# EAGLE design xmosio1 (EAGLE 7.6.0)
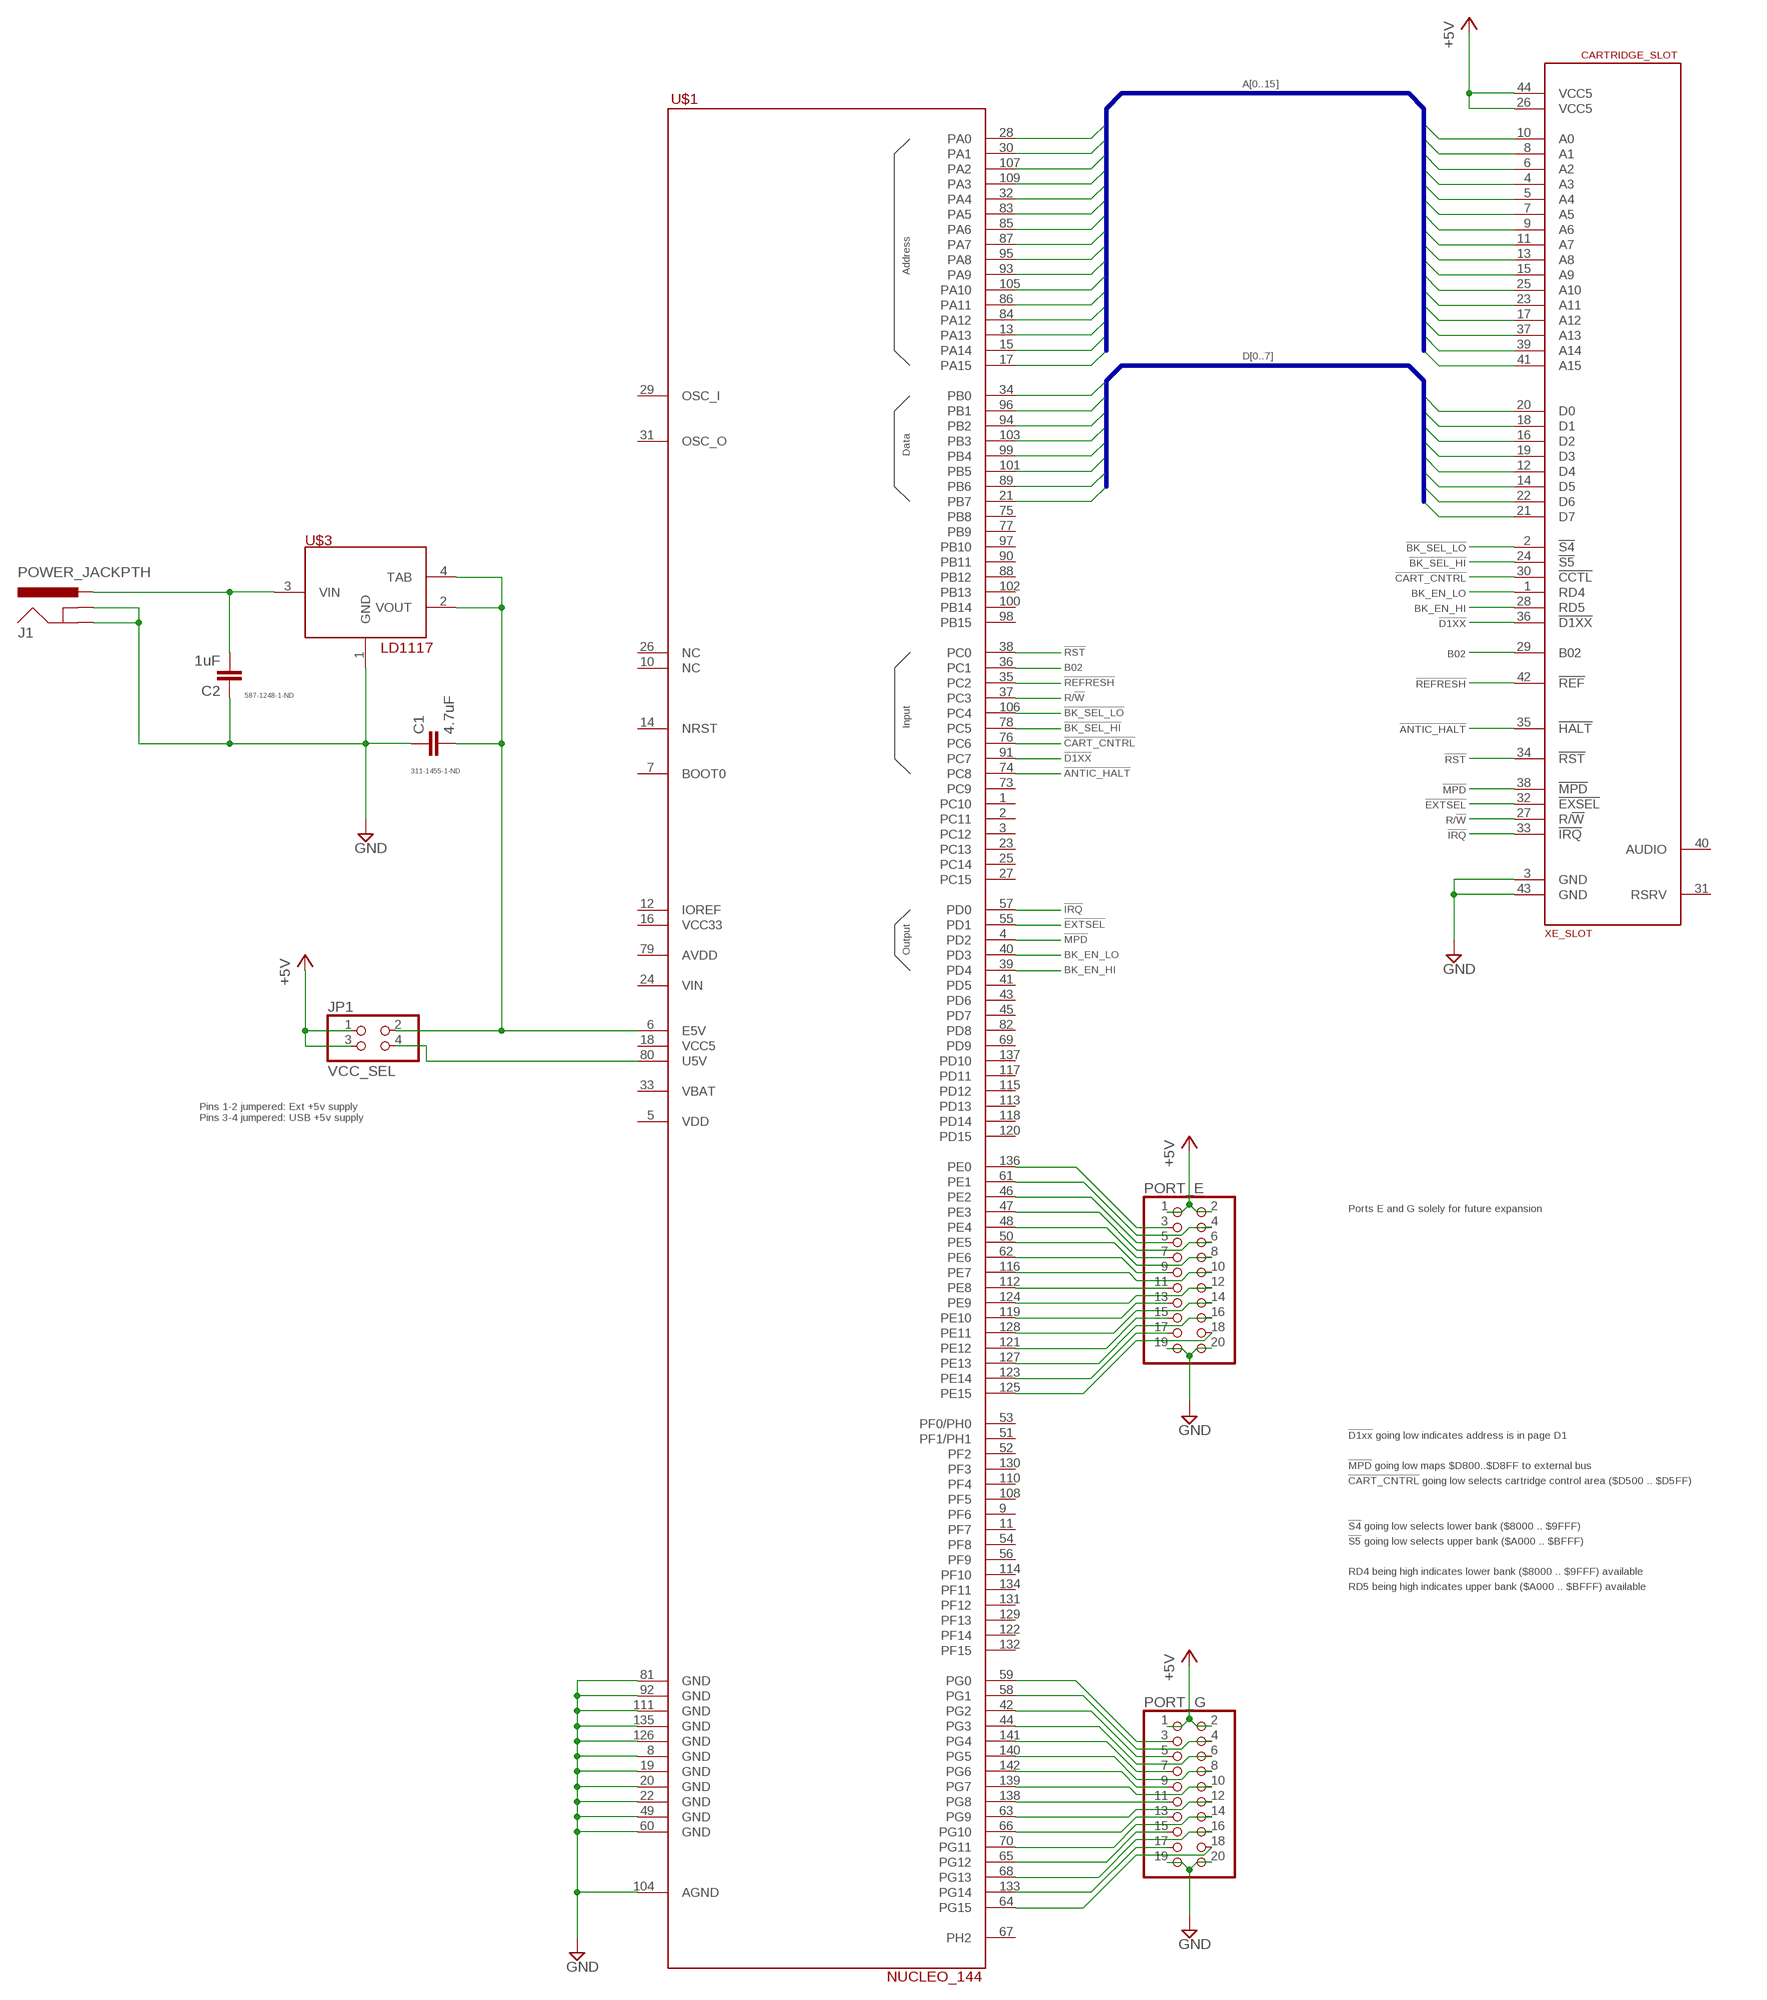
[diagram p0: schematic, sheet 1]

## Parts
C1  4.7uF  C-EUC0603  [C0603]
C2  1uF  C-EUC0603  [C0603]
CARTRIDGE_SLOT  XE_SLOT  [XE_SLOT]
J1  POWER_JACKPTH  [POWER_JACK_PTH]
JP1  VCC_SEL  PINHD-2X2  [2X02]
PORT_E  PINHD-2X10  [2X10]
PORT_G  PINHD-2X10  [2X10]
U$1  NUCLEO_144  [NUCLEO_144]
U$3  LD1117  [SOT223]

## Nets
!ANTIC_HALT!: CARTRIDGE_SLOT.35(!HALT!) U$1.74(PC8)
!BK_SEL_HI!: CARTRIDGE_SLOT.24(!S5!) U$1.78(PC5)
!BK_SEL_LO!: CARTRIDGE_SLOT.2(!S4!) U$1.106(PC4)
!CART_CNTRL!: CARTRIDGE_SLOT.30(!CCTL!) U$1.76(PC6)
!D1XX!: CARTRIDGE_SLOT.36(!D1XX!) U$1.91(PC7)
!EXTSEL!: CARTRIDGE_SLOT.32(!EXSEL!) U$1.55(PD1)
!IRQ!: CARTRIDGE_SLOT.33(!IRQ!) U$1.57(PD0)
!MPD!: CARTRIDGE_SLOT.38(!MPD!) U$1.4(PD2)
!REFRESH!: CARTRIDGE_SLOT.42(!REF!) U$1.35(PC2)
!RST!: CARTRIDGE_SLOT.34(!RST!) U$1.38(PC0)
+5V: CARTRIDGE_SLOT.26(VCC5) CARTRIDGE_SLOT.44(VCC5) JP1.1 JP1.3 PORT_E.1 PORT_E.2 PORT_G.1 PORT_G.2
A0: CARTRIDGE_SLOT.10(A0) U$1.28(PA0)
A1: CARTRIDGE_SLOT.8(A1) U$1.30(PA1)
A2: CARTRIDGE_SLOT.6(A2) U$1.107(PA2)
A3: CARTRIDGE_SLOT.4(A3) U$1.109(PA3)
A4: CARTRIDGE_SLOT.5(A4) U$1.32(PA4)
A5: CARTRIDGE_SLOT.7(A5) U$1.83(PA5)
A6: CARTRIDGE_SLOT.9(A6) U$1.85(PA6)
A7: CARTRIDGE_SLOT.11(A7) U$1.87(PA7)
A8: CARTRIDGE_SLOT.13(A8) U$1.95(PA8)
A9: CARTRIDGE_SLOT.15(A9) U$1.93(PA9)
A10: CARTRIDGE_SLOT.25(A10) U$1.105(PA10)
A11: CARTRIDGE_SLOT.23(A11) U$1.86(PA11)
A12: CARTRIDGE_SLOT.17(A12) U$1.84(PA12)
A13: CARTRIDGE_SLOT.37(A13) U$1.13(PA13)
A14: CARTRIDGE_SLOT.39(A14) U$1.15(PA14)
A15: CARTRIDGE_SLOT.41(A15) U$1.17(PA15)
B02: CARTRIDGE_SLOT.29(B02) U$1.36(PC1)
BK_EN_HI: CARTRIDGE_SLOT.28(RD5) U$1.39(PD4)
BK_EN_LO: CARTRIDGE_SLOT.1(RD4) U$1.40(PD3)
D0: CARTRIDGE_SLOT.20(D0) U$1.34(PB0)
D1: CARTRIDGE_SLOT.18(D1) U$1.96(PB1)
D2: CARTRIDGE_SLOT.16(D2) U$1.94(PB2)
D3: CARTRIDGE_SLOT.19(D3) U$1.103(PB3)
D4: CARTRIDGE_SLOT.12(D4) U$1.99(PB4)
D5: CARTRIDGE_SLOT.14(D5) U$1.101(PB5)
D6: CARTRIDGE_SLOT.22(D6) U$1.89(PB6)
D7: CARTRIDGE_SLOT.21(D7) U$1.21(PB7)
GND [ext-power]: C1.1 C2.1 CARTRIDGE_SLOT.3(GND) CARTRIDGE_SLOT.43(GND) J1.GND J1.GNDBREAK PORT_E.19 PORT_E.20 PORT_G.19 PORT_G.20 U$1.8(GND) U$1.19(GND) U$1.20(GND) U$1.22(GND) U$1.49(GND) U$1.60(GND) U$1.81(GND) U$1.92(GND) U$1.104(AGND) U$1.111(GND) U$1.126(GND) U$1.135(GND) U$3.1(GND)
N$1 [ext-power]: C1.2 JP1.2 U$1.6(E5V) U$3.2(VOUT) U$3.4(TAB)
N$2: JP1.4 U$1.80(U5V)
N$3: PORT_E.3 U$1.136(PE0)
N$4: PORT_E.4 U$1.61(PE1)
N$5: PORT_E.5 U$1.46(PE2)
N$6: PORT_E.6 U$1.47(PE3)
N$7: PORT_E.7 U$1.48(PE4)
N$8: PORT_E.8 U$1.50(PE5)
N$9: PORT_E.9 U$1.62(PE6)
N$10: PORT_E.10 U$1.116(PE7)
N$11: PORT_E.11 U$1.112(PE8)
N$12: PORT_E.12 U$1.124(PE9)
N$13: PORT_E.13 U$1.119(PE10)
N$14: PORT_E.14 U$1.128(PE11)
N$15: PORT_E.15 U$1.121(PE12)
N$16: PORT_E.16 U$1.127(PE13)
N$17: PORT_E.17 U$1.123(PE14)
N$18: PORT_E.18 U$1.125(PE15)
N$19: PORT_G.3 U$1.59(PG0)
N$20: PORT_G.4 U$1.58(PG1)
N$21: PORT_G.5 U$1.42(PG2)
N$22: PORT_G.6 U$1.44(PG3)
N$23: PORT_G.7 U$1.141(PG4)
N$24: PORT_G.8 U$1.140(PG5)
N$25: PORT_G.9 U$1.142(PG6)
N$26: PORT_G.11 U$1.138(PG8)
N$27 [ext-power]: C2.2 J1.PWR U$3.3(VIN)
N$28: PORT_G.12 U$1.63(PG9)
N$29: PORT_G.13 U$1.66(PG10)
N$30: PORT_G.14 U$1.70(PG11)
N$31: PORT_G.15 U$1.65(PG12)
N$32: PORT_G.16 U$1.68(PG13)
N$33: PORT_G.17 U$1.133(PG14)
N$34: PORT_G.18 U$1.64(PG15)
PORT_G: PORT_G.10 U$1.139(PG7)
R/!W!: CARTRIDGE_SLOT.27(R/!W!) U$1.37(PC3)
Unconnected: CARTRIDGE_SLOT.31(RSRV) CARTRIDGE_SLOT.40(AUDIO) U$1.1(PC10) U$1.2(PC11) U$1.3(PC12) U$1.5(VDD) U$1.7(BOOT0) U$1.9(PF6) U$1.10(NC) U$1.11(PF7) U$1.12(IOREF) U$1.14(NRST) U$1.16(VCC33) U$1.18(VCC5) U$1.23(PC13) U$1.24(VIN) U$1.25(PC14) U$1.26(NC) U$1.27(PC15) U$1.29(OSC_I) U$1.31(OSC_O) U$1.33(VBAT) U$1.41(PD5) U$1.43(PD6) U$1.45(PD7) U$1.51(PF1/PH1) U$1.52(PF2) U$1.53(PF0/PH0) U$1.54(PF8) U$1.56(PF9) U$1.67(PH2) U$1.69(PD9) U$1.73(PC9) U$1.75(PB8) U$1.77(PB9) U$1.79(AVDD) U$1.82(PD8) U$1.88(PB12) U$1.90(PB11) U$1.97(PB10) U$1.98(PB15) U$1.100(PB14) U$1.102(PB13) U$1.108(PF5) U$1.110(PF4) U$1.113(PD13) U$1.114(PF10) U$1.115(PD12) U$1.117(PD11) U$1.118(PD14) U$1.120(PD15) U$1.122(PF14) U$1.129(PF13) U$1.130(PF3) U$1.131(PF12) U$1.132(PF15) U$1.134(PF11) U$1.137(PD10)

## Buses
A[0..15]
D[0..7]

## Notes on the sheet
- Address
- Data
- 587-1248-1-ND
- Input
- 311-1455-1-ND
- Output
- Pins 1-2 jumpered: Ext +5v supply
  Pins 3-4 jumpered: USB +5v supply
- Ports E and G solely for future expansion
- !D1xx! going low indicates address is in page D1
- !MPD! going low maps $D800..$D8FF to external bus
- !CART_CNTRL! going low selects cartridge control area ($D500 .. $D5FF)
- !S4! going low selects lower bank ($8000 .. $9FFF)
- !S5! going low selects upper bank ($A000 .. $BFFF)
- RD4 being high indicates lower bank ($8000 .. $9FFF) available
- RD5 being high indicates upper bank ($A000 .. $BFFF) available

## Library data of the parts
C1 C2 = rcl:C-EU: CAPACITOR, European symbol
CARTRIDGE_SLOT = pbxl:XE_SLOT
J1 = SparkFun-Connectors:POWER_JACK: Power Jack This is the standard 5.5mm barrel jack for power. The PTH is the most common, proven, reliable, footprint. The Slot footprint only works if the mill layer is transmitted to the PCB fab house so be warned. Mating wall wart : TOL-00298 (and others); PROD_ID: PRT-00119
JP1 = pinhead:PINHD-2X2: PIN HEADER
PORT_E PORT_G = pinhead:PINHD-2X10: PIN HEADER
U$1 = pbxl:NUCLEO_144
U$3 = sjg-power:LD1117

## Net classes
1 ext-power: width 0.305 mm

## Board
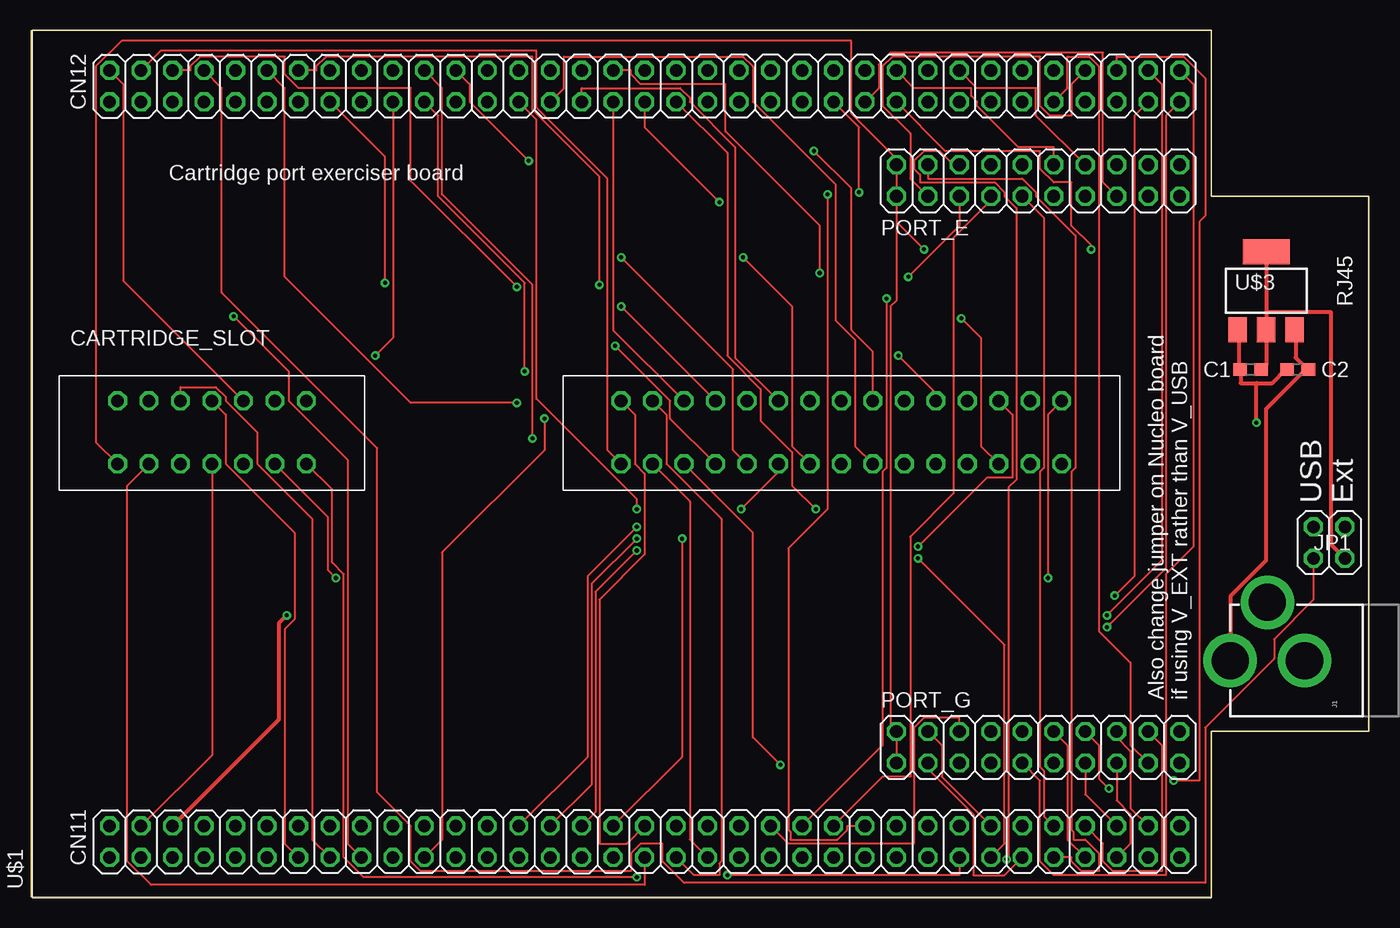
[diagram p1: board, top side]
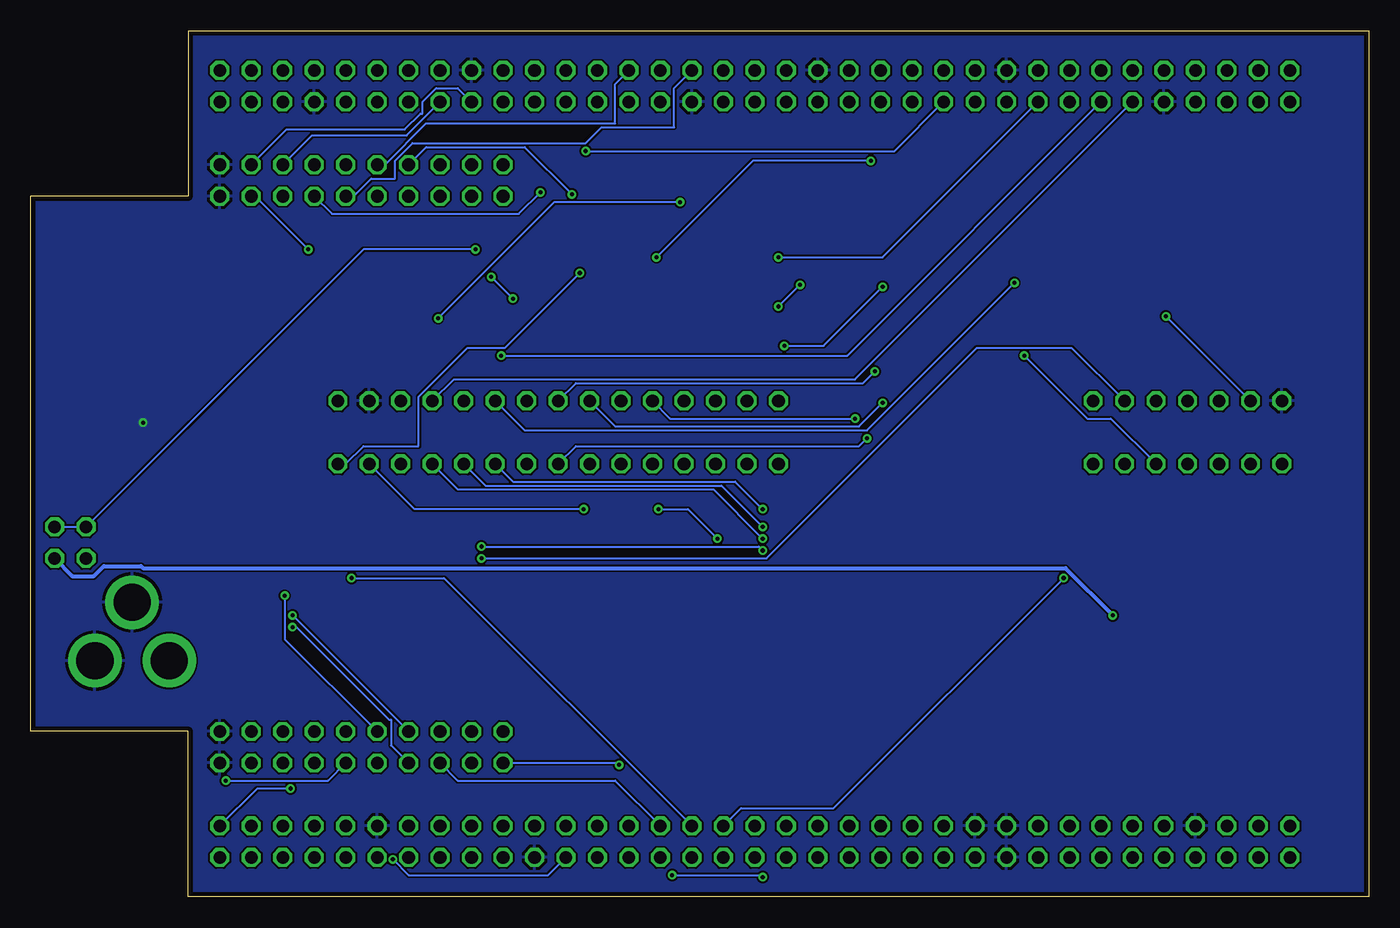
[diagram p2: board, bottom side, seen from below]

Size 107.95 x 69.85 mm. Coordinates in mm from the lower left corner, seen from the top.
Outline: 0,0 95.25,0 95.25,13.34 107.95,13.34 107.95,56.52 95.25,56.52 95.25,69.85 0,69.85 0,0
Copper layers (1*16): Top 0.0356mm / dielectric 1.5011mm / Bottom 0.0356mm
Design rules "oshpark-2layer": minimum track width 6mil, minimum drill 13mil, track to track 6mil, track to pad 6mil, pad to pad 6mil, via to via 6mil, smd to smd 6mil, copper to edge 15mil, drill to drill 6mil, minimum pad ring 7mil, minimum via ring 7mil, stop-mask expansion 2.5mil, vias tented up to drill 0mil, thermal gap 10mil
vRestrict: area 89.5,15.2 to 94.6,54.6; area 1.3,56.5 to 36.2,59.7; area 2.5,1.9 to 5.1,7.6; area 2.5,43.8 to 19.1,46.4; area 0,61.6 to 95.2,69.8; area 67.3,52.7 to 95.2,61.6; area 1.3,31.7 to 27.9,43.2; area 41.9,31.7 to 88.9,43.2; area 94.6,38.7 to 108,54; area 95.2,25.4 to 107.9,36.8

### Footprints (pad centres in the part's own frame; a part is rotated, then mirrored left to right if it is on the bottom)
C0603 = smd 1.1 x 1: 1 -0.85,0; 2 0.85,0
XE_SLOT = drill 1.016 octagon: 1 -2.54,41.91; 2 2.54,41.91; 3 -2.54,39.37; 4 2.54,39.37; 5 -2.54,36.83; 6 2.54,36.83; 7 -2.54,34.29; 8 2.54,34.29; 9 -2.54,31.75; 10 2.54,31.75; 11 -2.54,29.21; 12 2.54,29.21; 13 -2.54,26.67; 14 2.54,26.67; 15 -2.54,24.13; 16 2.54,24.13; 17 -2.54,21.59; 18 2.54,21.59; 19 -2.54,19.05; 20 2.54,19.05; 21 -2.54,16.51; 22 2.54,16.51; 23 -2.54,13.97; 24 2.54,13.97; 25 -2.54,11.43; 26 2.54,11.43; 27 -2.54,8.89; 28 2.54,8.89; 29 -2.54,6.35; 30 2.54,6.35; 31 -2.54,-19.05; 32 2.54,-19.05; 33 -2.54,-21.59; 34 2.54,-21.59; 35 -2.54,-24.13; 36 2.54,-24.13; 37 -2.54,-26.67; 38 2.54,-26.67; 39 -2.54,-29.21; 40 2.54,-29.21; 41 -2.54,-31.75; 42 2.54,-31.75; 43 -2.54,-34.29; 44 2.54,-34.29
POWER_JACK_PTH = drill 2.997 pad 4.318: GND 0,7.7; GNDBREAK 4.7,10.7; PWR 0,13.7
2X02 = drill 1.016 octagon: 1 -1.27,-1.27; 2 -1.27,1.27; 3 1.27,-1.27; 4 1.27,1.27
2X10 = drill 1.016 octagon: 1 -11.43,-1.27; 2 -11.43,1.27; 3 -8.89,-1.27; 4 -8.89,1.27; 5 -6.35,-1.27; 6 -6.35,1.27; 7 -3.81,-1.27; 8 -3.81,1.27; 9 -1.27,-1.27; 10 -1.27,1.27; 11 1.27,-1.27; 12 1.27,1.27; 13 3.81,-1.27; 14 3.81,1.27; 15 6.35,-1.27; 16 6.35,1.27; 17 8.89,-1.27; 18 8.89,1.27; 19 11.43,-1.27; 20 11.43,1.27
NUCLEO_144 = drill 1.016 octagon: 1 -34.29,40.64; 2 -31.75,40.64; 3 -34.29,38.1; 4 -31.75,38.1; 5 -34.29,35.56; 6 -31.75,35.56; 7 -34.29,33.02; 8 -31.75,33.02; 9 -34.29,30.48; 10 -31.75,30.48; 11 -34.29,27.94; 12 -31.75,27.94; 13 -34.29,25.4; 14 -31.75,25.4; 15 -34.29,22.86; 16 -31.75,22.86; 17 -34.29,20.32; 18 -31.75,20.32; 19 -34.29,17.78; 20 -31.75,17.78; 21 -34.29,15.24; 22 -31.75,15.24; 23 -34.29,12.7; 24 -31.75,12.7; 25 -34.29,10.16; 26 -31.75,10.16; 27 -34.29,7.62; 28 -31.75,7.62; 29 -34.29,5.08; 30 -31.75,5.08; 31 -34.29,2.54; 32 -31.75,2.54; 33 -34.29,0; 34 -31.75,0; 35 -34.29,-2.54; 36 -31.75,-2.54; 37 -34.29,-5.08; 38 -31.75,-5.08; 39 -34.29,-7.62; 40 -31.75,-7.62; 41 -34.29,-10.16; 42 -31.75,-10.16; 43 -34.29,-12.7; 44 -31.75,-12.7; 45 -34.29,-15.24; 46 -31.75,-15.24; 47 -34.29,-17.78; 48 -31.75,-17.78; 49 -34.29,-20.32; 50 -31.75,-20.32; 51 -34.29,-22.86; 52 -31.75,-22.86; 53 -34.29,-25.4; 54 -31.75,-25.4; 55 -34.29,-27.94; 56 -31.75,-27.94; 57 -34.29,-30.48; 58 -31.75,-30.48; 59 -34.29,-33.02; 60 -31.75,-33.02; 61 -34.29,-35.56; 62 -31.75,-35.56; 63 -34.29,-38.1; 64 -31.75,-38.1; 65 -34.29,-40.64; 66 -31.75,-40.64; 67 -34.29,-43.18; 68 -31.75,-43.18; 69 -34.29,-45.72; 70 -31.75,-45.72; 73 26.67,40.64; 74 29.21,40.64; 75 26.67,38.1; 76 29.21,38.1; 77 26.67,35.56; 78 29.21,35.56; 79 26.67,33.02; 80 29.21,33.02; 81 26.67,30.48; 82 29.21,30.48; 83 26.67,27.94; 84 29.21,27.94; 85 26.67,25.4; 86 29.21,25.4; 87 26.67,22.86; 88 29.21,22.86; 89 26.67,20.32; 90 29.21,20.32; 91 26.67,17.78; 92 29.21,17.78; 93 26.67,15.24; 94 29.21,15.24; 95 26.67,12.7; 96 29.21,12.7; 97 26.67,10.16; 98 29.21,10.16; 99 26.67,7.62; 100 29.21,7.62; 101 26.67,5.08; 102 29.21,5.08; 103 26.67,2.54; 104 29.21,2.54; 105 26.67,0; 106 29.21,0; 107 26.67,-2.54; 108 29.21,-2.54; 109 26.67,-5.08; 110 29.21,-5.08; 111 26.67,-7.62; 112 29.21,-7.62; 113 26.67,-10.16; 114 29.21,-10.16; 115 26.67,-12.7; 116 29.21,-12.7; 117 26.67,-15.24; 118 29.21,-15.24; 119 26.67,-17.78; 120 29.21,-17.78; 121 26.67,-20.32; 122 29.21,-20.32; 123 26.67,-22.86; 124 29.21,-22.86; 125 26.67,-25.4; 126 29.21,-25.4; 127 26.67,-27.94; 128 29.21,-27.94; 129 26.67,-30.48; 130 29.21,-30.48; 131 26.67,-33.02; 132 29.21,-33.02; 133 26.67,-35.56; 134 29.21,-35.56; 135 26.67,-38.1; 136 29.21,-38.1; 137 26.67,-40.64; 138 29.21,-40.64; 139 26.67,-43.18; 140 29.21,-43.18; 141 26.67,-45.72; 142 29.21,-45.72
SOT223 = smd 1.5 x 2: 1 -2.3,-3.15; 2 0,-3.15; 3 2.3,-3.15 | smd 3.8 x 2: 4 0,3.15

### Placement (x,y rotation side)
C1  98.42,42.55 0 top
C2  102.23,42.55 0 top
CARTRIDGE_SLOT  41.27,37.47 270 top
J1  110.49,19.05 90 top
JP1  104.78,28.57 180 top
PORT_E  81.28,57.79 0 top
PORT_G  81.28,12.06 0 top
U$1  46.99,37.47 90 top
U$3  99.69,48.9 0 top

### Tracks (layer width: path | path; a pad name or v marks a point on that pad's centre or on a via)
!ANTIC_HALT!
  Top 0.152: CARTRIDGE_SLOT.35 7.46,49.69 7.46,65.56 U$1.74
!BK_SEL_HI!  (via drill 0.33)
  Top 0.152: U$1.78 12.86,66.67 12.86,66.99 13.65,67.79 20.48,67.79 20.48,66.36 21.59,65.25 30.64,65.25 30.64,57.79 v39.21,49.21 | v47.15,44.45 51.59,40.01 51.59,38.58 CARTRIDGE_SLOT.24
  Bottom 0.152: v39.21,49.21 43.97,44.45 v47.15,44.45
!BK_SEL_LO!  (via drill 0.33)
  Top 0.152: U$1.106 48.42,66.67 48.42,66.36 49.21,65.56 56.04,65.56 56.04,61.75 63.66,54.13 v63.66,50.32
  Bottom 0.152: v63.66,50.32 69.69,44.29 72.71,44.29 76.68,40.32 76.68,36.35 81.12,36.35 82.55,34.93 CARTRIDGE_SLOT.2
!CART_CNTRL!
  Top 0.152: U$1.76 10.48,68.26 40.8,68.26 40.8,63.66 46.51,57.94 46.51,36.04 CARTRIDGE_SLOT.30
!D1XX!  (via drill 0.33)
  Top 0.152: v27.78,43.66 29.21,45.09 U$1.91
  Bottom 0.152: CARTRIDGE_SLOT.36 20.8,38.58 22.7,38.58 v27.78,43.66
!EXTSEL!  (via drill 0.33)
  Top 0.152: CARTRIDGE_SLOT.32 24.29,32.86 24.29,26.99 25.24,26.04 25.24,3.17 26.83,1.59 v48.9,1.59 | v56.2,1.75 74.93,1.75 U$1.55
  Bottom 0.152: v48.9,1.59 49.05,1.75 v56.2,1.75
!IRQ!  (via drill 0.33)
  Top 0.152: v71.6,27.3 78.58,20.32 78.58,4.29 U$1.57
  Bottom 0.152: CARTRIDGE_SLOT.33 23.97,44.29 31.59,44.29 48.58,27.3 v71.6,27.3
!MPD!
  Top 0.152: U$1.4 14.61,11.43 CARTRIDGE_SLOT.38
!REFRESH!
  Top 0.152: CARTRIDGE_SLOT.42 7.78,33.18 7.78,2.86 9.68,0.95 49.53,0.95 U$1.35
!RST!  (via drill 0.33)
  Top 0.152: CARTRIDGE_SLOT.34 23.97,30.64 23.97,26.35 v24.61,25.72
  Bottom 0.152: v24.61,25.72 43.18,7.14 50.64,7.14 U$1.38
+5V  (via drill 0.33)
  Top 0.152: PORT_G.1 PORT_G.2 69.37,13.81 69.37,47.62 69.85,48.1 69.85,54.45 | CARTRIDGE_SLOT.26 58.26,29.37 58.26,12.86 v60.48,10.64 | CARTRIDGE_SLOT.44 5.24,36.67 5.24,66.99 7.3,69.06 66.2,69.06 66.2,63.18 69.85,59.53 PORT_E.2 PORT_E.1 69.85,54.45 | 69.85,54.45 v72.07,52.23
  Bottom 0.152: v60.48,10.64 60.64,10.79 PORT_G.1 | JP1.1 JP1.3 81.12,52.23 v72.07,52.23
A0  (via drill 0.33)
  Top 0.152: U$1.28 44.93,11.27 44.93,25.88 v48.9,29.84
  Bottom 0.152: v48.9,29.84 52.23,33.18 71.28,33.18 CARTRIDGE_SLOT.10
A1  (via drill 0.33)
  Top 0.152: U$1.30 45.24,9.05 45.24,25.24 v48.9,28.89
  Bottom 0.152: v48.9,28.89 52.86,32.86 73.5,32.86 CARTRIDGE_SLOT.8
A2  (via drill 0.33)
  Top 0.152: CARTRIDGE_SLOT.6 76.68,36.35 76.68,45.09 v75.09,46.67 | v55.56,56.04 49.53,62.07 U$1.107
  Bottom 0.152: v75.09,46.67 65.72,56.04 v55.56,56.04
A3  (via drill 0.33)
  Top 0.152: v63.34,31.27 61.44,33.18 61.44,35.88 58.9,38.42 58.9,40.96 56.2,43.66 56.2,60.01 U$1.109
  Bottom 0.152: CARTRIDGE_SLOT.4 76.99,31.27 v63.34,31.27
A4  (via drill 0.33)
  Top 0.152: U$1.32 45.56,6.83 45.56,24.61 v48.9,27.94 | v71.6,28.26 77.15,33.81 79.22,33.81 79.22,38.89 CARTRIDGE_SLOT.5
  Bottom 0.152: v48.9,27.94 49.21,28.26 v71.6,28.26
A5
  Bottom 0.152: U$1.83 41.43,41.75 73.82,41.75 CARTRIDGE_SLOT.7
A6  (via drill 0.33)
  Top 0.152: v70.01,43.66 73.03,40.64 CARTRIDGE_SLOT.9
  Bottom 0.152: U$1.85 42.07,43.66 v70.01,43.66
A7  (via drill 0.33)
  Top 0.152: U$1.87 28.57,59.69 v28.57,49.53
  Bottom 0.152: v28.57,49.53 40.48,37.62 68.1,37.62 CARTRIDGE_SLOT.11
A8  (via drill 0.33)
  Top 0.152: v63.18,60.17 66.2,57.15 66.2,45.72 67.94,43.97 CARTRIDGE_SLOT.13
  Bottom 0.152: U$1.95 38.26,60.17 v63.18,60.17
A9  (via drill 0.33)
  Top 0.152: U$1.93 32.86,63.02 32.86,56.52 39.85,49.53 v39.85,42.39
  Bottom 0.152: v39.85,42.39 40.8,41.43 63.98,41.43 CARTRIDGE_SLOT.15
A10
  Top 0.152: CARTRIDGE_SLOT.25 46.99,45.72 U$1.105
A11  (via drill 0.33)
  Top 0.152: U$1.86 23.02,66.67 23.02,66.99 23.81,67.79 40.48,67.79 40.48,63.5 45.88,58.1 v45.88,49.37 | CARTRIDGE_SLOT.23 v47.62,47.62
  Bottom 0.152: v47.62,47.62 v45.88,49.37
A12  (via drill 0.33)
  Top 0.152: U$1.84 20.48,65.25 20.48,50.01 30.64,39.85 v39.21,39.85
  Bottom 0.152: v39.21,39.85 41.12,37.94 60.8,37.94 CARTRIDGE_SLOT.17
A13
  Top 0.152: U$1.13 20.48,4.29 20.48,21.59 21.27,22.38 21.27,29.37 15.72,34.93 15.72,38.89 CARTRIDGE_SLOT.37
A14
  Top 0.152: U$1.15 22.7,4.6 22.7,30.48 18.26,34.93 18.26,37.47 15.72,40.01 15.72,40.32 14.92,41.12 12.06,41.12 CARTRIDGE_SLOT.39
A15  (via drill 0.33)
  Top 0.152: U$1.17 25.56,4.29 25.56,35.24 20.8,40.01 20.8,42.39 v16.35,46.83
  Bottom 0.152: CARTRIDGE_SLOT.41 v16.35,46.83
B02
  Top 0.152: U$1.36 48.1,4.29 45.88,4.29 45.88,23.97 49.53,27.62 49.53,34.13 48.74,34.93 48.74,38.89 CARTRIDGE_SLOT.29
BK_EN_HI
  Top 0.152: U$1.39 53.18,4.6 53.18,31.91 CARTRIDGE_SLOT.28
BK_EN_LO  (via drill 0.33)
  Top 0.152: v82.07,25.72 82.07,38.89 CARTRIDGE_SLOT.1
  Bottom 0.152: U$1.40 74.61,25.72 v82.07,25.72
D0  (via drill 0.33)
  Top 0.152: U$1.34 52.55,11.27 v52.55,28.89 | v57.31,31.27 60.33,34.29 CARTRIDGE_SLOT.20
  Bottom 0.152: v52.55,28.89 54.93,31.27 v57.31,31.27
D1  (via drill 0.33)
  Top 0.152: CARTRIDGE_SLOT.18 61.44,36.35 61.44,47.62 v57.47,51.59 | v40.16,59.37 35.4,64.13 35.4,65.56 U$1.96
  Bottom 0.152: v57.47,51.59 49.69,59.37 v40.16,59.37
D2  (via drill 0.33)
  Top 0.152: U$1.94 33.18,65.25 33.18,56.67 40.48,49.37 v40.48,36.99
  Bottom 0.152: v40.48,36.99 41.12,36.35 63.98,36.35 CARTRIDGE_SLOT.16
D3
  Top 0.152: CARTRIDGE_SLOT.19 56.83,43.5 56.83,60.48 53.18,64.13 53.18,64.45 52.39,65.25 44.45,65.25 U$1.103
D4  (via drill 0.33)
  Top 0.152: U$1.99 40.8,62.71 40.8,40.16 48.9,32.07 v48.9,31.27
  Bottom 0.152: v48.9,31.27 51.12,33.5 69.06,33.5 CARTRIDGE_SLOT.12
D5
  Top 0.152: CARTRIDGE_SLOT.14 66.52,36.35 66.52,44.93 64.93,46.51 64.93,57.47 58.26,64.13 58.26,66.99 57.47,67.79 43.02,67.79 43.02,65.25 U$1.101
D6  (via drill 0.33)
  Top 0.152: v47.62,51.59 56.67,42.55 56.67,36.04 CARTRIDGE_SLOT.22
  Bottom 0.152: U$1.89 39.21,51.59 v47.62,51.59
D7  (via drill 0.33)
  Top 0.152: U$1.21 33.18,4.6 33.18,27.78 41.43,36.04 v41.43,38.58
  Bottom 0.152: v41.43,38.58 56.36,38.58 CARTRIDGE_SLOT.21
GND  (via drill 0.33)
  Top 0.305: U$3.1 97.47,45.72 97.47,42.55 C1.1 97.63,42.55 97.63,41.43 98.9,41.43 | 98.9,41.43 100.17,41.43 101.28,42.55 C2.1 | v98.9,38.26 98.9,41.43
  pour Bottom: 0,69.85 95.25,69.85 95.25,0 0,0
  pour Bottom: 95.25,56.52 107.95,56.52 107.95,13.34 95.25,13.34
N$1  (via drill 0.33)
  Top 0.305: C1.2 99.38,42.55 99.69,42.86 U$3.2 99.69,47.15 | U$3.4 99.69,47.15 | U$1.6 20,14.29 20,22.07 v20.64,22.7 | 99.69,47.15 104.93,47.15 104.93,28.42 JP1.2
  Bottom 0.305: v20.64,22.7 24.45,26.51 98.9,26.51 99.06,26.67 102.08,26.67 102.87,25.88 104.62,25.88 JP1.2
N$2
  Top 0.152: U$1.80 15.4,65.25 15.4,48.74 27.94,36.2 27.94,8.41 30.64,5.71 30.64,2.86 31.43,2.06 48.42,2.06 48.42,3.49 49.21,4.29 50.96,4.29 50.96,2.86 52.7,1.11 94.77,1.11 94.77,13.65 100.33,19.21 100.33,20.8 103.5,23.97 JP1.4
N$3
  Top 0.152: PORT_E.3 70.96,57.94 70.96,61.59 68.74,63.82 68.74,66.99 69.53,67.79 81.44,67.79 81.44,63.82 82.23,63.02 83.98,63.02 83.98,65.56 U$1.136
N$4
  Top 0.152: U$1.61 83.98,3.17 83.98,2.86 84.77,2.06 86.2,2.06 86.2,3.49 85.09,4.6 84.14,4.6 84.14,5.24 83.98,5.4 83.98,34.29 84.3,34.61 84.3,53.34 81.12,56.52 81.12,56.83 80.01,57.94 72.39,57.94 PORT_E.4
N$5  (via drill 0.33)
  Top 0.152: U$1.46 68.74,12.22 68.74,34.29 69.06,34.61 v69.06,48.26 | v70.8,50.01 74.93,54.13 PORT_E.5
  Bottom 0.152: v70.8,50.01 v69.06,48.26
N$6  (via drill 0.33)
  Top 0.152: v78.74,3.02 78.9,3.17 78.9,33.02 79.53,33.66 79.53,55.56 78.58,56.52 78.58,56.83 77.79,57.63 71.75,57.63 71.75,58.26 71.28,58.74 71.28,59.37 72.07,60.17 73.34,60.17 74.45,59.05 PORT_E.6
  Bottom 0.152: U$1.47 66.2,1.75 77.47,1.75 v78.74,3.02
N$7
  Top 0.152: U$1.48 68.74,9.68 70.96,9.68 70.96,29.05 74.45,32.54 74.45,53.18 77.47,56.2 PORT_E.7
N$8  (via drill 0.33)
  Top 0.152: U$1.50 65.88,5.71 65.88,5.4 65.09,4.6 61.28,4.6 61.28,5.24 61.12,5.4 61.12,28.1 64.29,31.27 v64.29,56.67
  Bottom 0.152: v64.29,56.67 68.1,60.48 76.04,60.48 PORT_E.8
N$9
  Top 0.152: U$1.62 81.76,6.51 81.76,10.16 81.44,10.48 81.44,34.29 81.76,34.61 81.76,54.77 PORT_E.9
N$10
  Bottom 0.152: U$1.116 60.8,65.56 60.8,62.39 76.04,62.39 79.38,59.05 PORT_E.10
N$11
  Bottom 0.152: U$1.112 56.04,65.25 56.04,62.07 61.91,62.07 63.18,60.8 77.15,60.8 78.58,59.37 78.58,57.94 80.49,57.94 81.92,56.52 PORT_E.11
N$12
  Top 0.152: U$1.124 71.28,65.25 75.88,65.25 75.88,64.61 76.36,64.13 76.36,63.82 79.69,60.48 82.55,60.48 PORT_E.12
N$13  (via drill 0.33)
  Top 0.152: U$1.119 66.83,62.07 v66.83,56.83
  Bottom 0.152: v66.83,56.83 68.58,55.09 83.66,55.09 PORT_E.13
N$14
  Top 0.152: U$1.128 76.36,65.25 81.12,65.25 81.12,63.02 PORT_E.14
N$15
  Top 0.152: U$1.121 68.42,65.25 68.42,67.15 69.37,68.1 86.52,68.1 86.52,57.63 PORT_E.15
N$16
  Bottom 0.152: U$1.127 77.63,61.44 85.25,61.44 PORT_E.16
N$17  (via drill 0.33)
  Top 0.152: U$1.123 73.82,60.17 81.44,60.17 81.44,58.74 82.55,57.63 83.98,57.63 83.98,54.13 85.57,52.55 v85.57,52.23
  Bottom 0.152: v85.57,52.23 89.85,56.52 PORT_E.17
N$18
  Bottom 0.152: U$1.125 73.5,65.25 75.25,65.25 76.36,64.13 76.36,63.18 76.52,63.18 77.79,61.91 87.31,61.91 PORT_E.18
N$19
  Top 0.152: U$1.59 78.58,1.75 76.04,1.75 76.04,6.67 72.39,10.32 PORT_G.3
N$20
  Top 0.152: U$1.58 73.5,9.68 73.5,12.22 PORT_G.4
N$21
  Bottom 0.152: U$1.42 60.8,9.37 73.5,9.37 PORT_G.5
N$22
  Top 0.152: U$1.44 61.12,4.29 71.28,4.29 71.28,13.65 72.07,14.45 74.93,14.45 PORT_G.6
N$23  (via drill 0.33)
  Top 0.152: v86.84,21.75 91.6,26.51 91.6,63.02 U$1.141
  Bottom 0.152: PORT_G.7 78.9,12.22 78.9,14.29 79.06,14.29 86.52,21.75 v86.84,21.75
N$24  (via drill 0.33)
  Top 0.152: v86.84,22.7 91.28,27.15 91.28,65.56 U$1.140
  Bottom 0.152: v86.84,22.7 PORT_G.8
N$25
  Top 0.152: PORT_G.9 81.44,9.37 81.44,2.86 82.55,1.75 91.6,1.75 91.6,26.04 93.82,28.26 93.82,65.56 U$1.142
N$26  (via drill 0.33)
  Top 0.152: v92.23,9.37 94.3,9.37 94.3,54.45 94.77,54.93 94.77,66.04 93.03,67.79 87.63,67.79 U$1.138
  Bottom 0.152: PORT_G.11 83.98,9.37 v92.23,9.37
N$27
  Top 0.305: U$3.3 102.08,45.72 102.08,43.5 103.03,42.55 C2.2 102.87,42.55 99.69,39.37 99.69,27.15 96.84,24.29 96.84,19.05 J1.PWR
N$28
  Top 0.152: U$1.63 83.66,4.6 83.66,12.22 PORT_G.12
N$29
  Top 0.152: U$1.66 85.09,8.26 PORT_G.13
N$30  (via drill 0.33)
  Top 0.152: v87,8.73 86.2,9.53 86.2,12.22 PORT_G.14
  Bottom 0.152: U$1.70 89.69,8.73 v87,8.73
N$31
  Top 0.152: U$1.65 88.74,4.29 88.74,6.67 87.63,7.78 PORT_G.15
N$32
  Top 0.152: U$1.68 88.74,7.14 88.74,11.75 87.63,12.86 PORT_G.16
N$33
  Top 0.152: PORT_G.17 88.74,12.22 88.74,18.89 86.2,21.43 86.2,66.99 85.41,67.79 83.66,67.79 83.66,65.25 U$1.133
N$34
  Top 0.152: U$1.64 86.52,4.29 86.52,2.86 87.31,2.06 91.28,2.06 91.28,12.22 PORT_G.18
PORT_G  (via drill 0.33)
  Top 0.152: v87.47,24.29 89.06,25.88 89.06,63.02 U$1.139
  Bottom 0.152: PORT_G.10 87.47,20.8 v87.47,24.29
R/!W!
  Top 0.152: U$1.37 53.5,1.75 55.56,1.75 55.56,2.7 55.72,2.86 55.72,30.48 51.28,34.93 51.28,38.89 CARTRIDGE_SLOT.27

### Text on the board
tPlace: Cartridge port exerciser board | USB | Ext | Also change jumper on Nucleo board / if using V_EXT rather than V_USB